# EAGLE design Schametics (EAGLE 9.6.2)
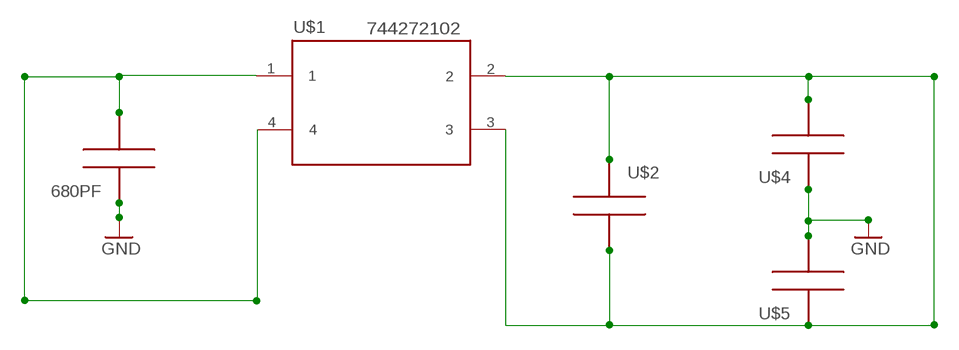
[diagram p0: schematic, sheet 1]

## Parts
680PF  CAPA1206  [FGJGFN]
U$1  CHOKE  [CHOKE]
U$2  CAPA1206  [FGJGFN]
U$4  CAPA1206  [FGJGFN]
U$5  CAPA1206  [FGJGFN]

## Nets
GND: 680PF.2
N$3: 680PF.1 U$1.4
N$4: U$1.2
N$5: U$4.2 U$5.1
N$6: U$1.1
N$7: U$1.3 U$4.1 U$5.2
N$8: U$2.1
N$9: U$2.2

## Notes on the sheet
- C1=1500pF

## Library data of the parts
680PF U$2 U$4 U$5 = capa:CAPA
U$1 = CHOKE:CHOKE

## Board
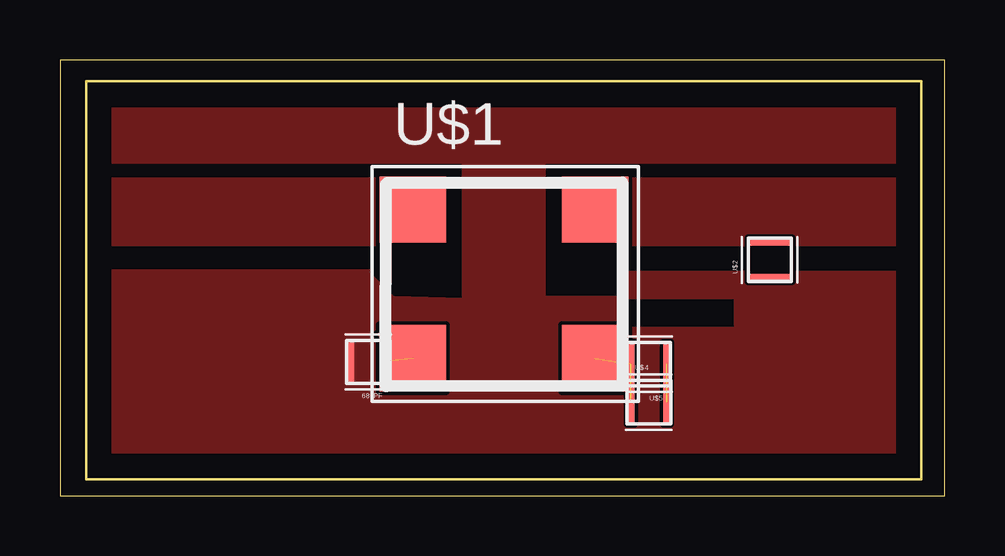
[diagram p1: board, top side]

Size 36.89 x 18.18 mm. Coordinates in mm from the lower left corner, seen from the top.
Outline: 0,0 36.89,0 36.89,18.18 0,18.18 0,0
Outline: 1.1,17.3 35.9,17.3 35.9,0.7 1.1,0.7 1.1,17.3
Copper layers (1*16): Top 0.035mm / dielectric 1.5mm / Bottom 0.035mm
Design rules "default": minimum track width 6mil, minimum drill 0.35mm, track to track 6mil, track to pad 6mil, pad to pad 6mil, via to via 6mil, smd to smd 6mil, copper to edge 40mil, drill to drill 6mil, minimum pad ring 10mil, minimum via ring 8mil, stop-mask expansion 4mil, vias tented up to drill 0mil, thermal gap 10mil

### Footprints (pad centres in the part's own frame; a part is rotated, then mirrored left to right if it is on the bottom)
FGJGFN = smd 0.3 x 1.8: 1 -0.8,0; 2 0.7,0
CHOKE = smd 2.76 x 2.76: 1 -3.79,2.54; 2 3.81,2.54; 3 3.81,-3.66; 4 -3.79,-3.66

### Placement (x,y rotation side)
680PF  12.8,5.6 180 top
U$1  18.5,9.4 0 top
U$2  29.6,9.9 90 top
U$4  24.6,3.9 0 top
U$5  24.5,5.5 180 top

### Tracks (layer width: path | path; a pad name or v marks a point on that pad's centre or on a via)
GND
  pour Top (no thermals): 1.5,9.4 13,9.4 12.8,9.4 13.9,8.3 16.8,8.21 16.8,13.9 1.5,13.9 1.5,16.5 35.5,16.5 35.5,13.9 20.2,13.9 20.2,8.3 23.6,8.3 23.6,7 35.4,7 35.4,1.2 1.5,1.2
  pour Top (no thermals): 23.6,8.3 23.6,9.3 35.4,9.3 35.4,7.1 28.2,7.1 28.2,8.3
N$1
  pour Top (no thermals): 1.6,13.2 16.1,13.2 16.1,10.5 1.6,10.5
N$2
  pour Top (no thermals): 20.9,13.2 35.4,13.2 35.4,10.5 20.9,10.5
N$3  (1 unrouted)
  Top 0.152: 13.3,6.73 13.75,6.73 13.88,6.6 13.88,6.57 U$1.4
N$5  (1 unrouted)
N$7  (2 unrouted)